# EAGLE design pedometer_blackbox (EAGLE 5.06)
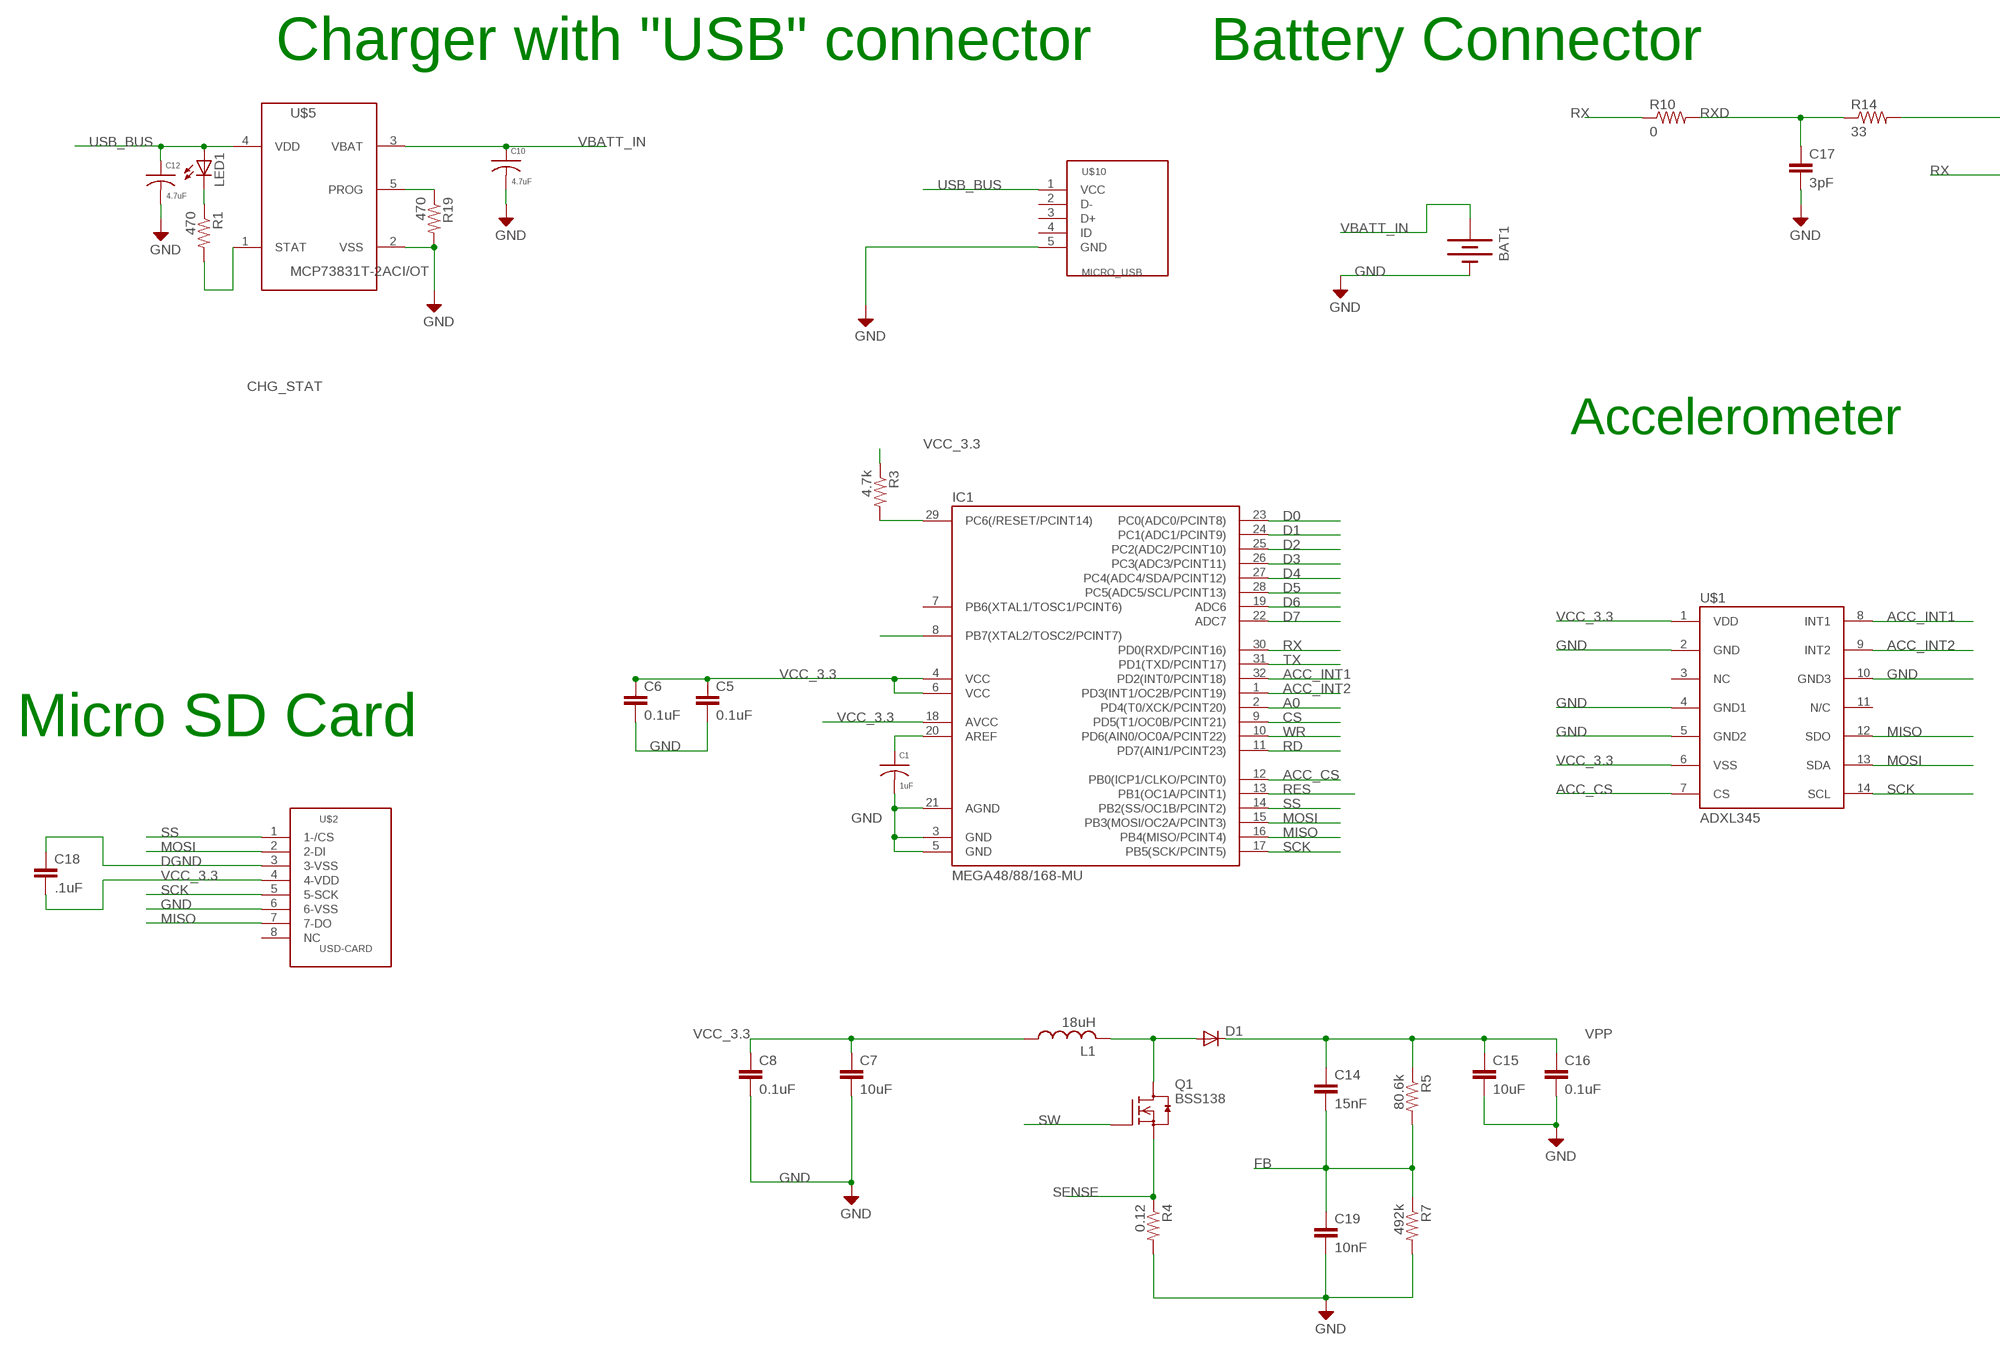
[diagram p0: schematic, sheet 1, part 1 of 2]
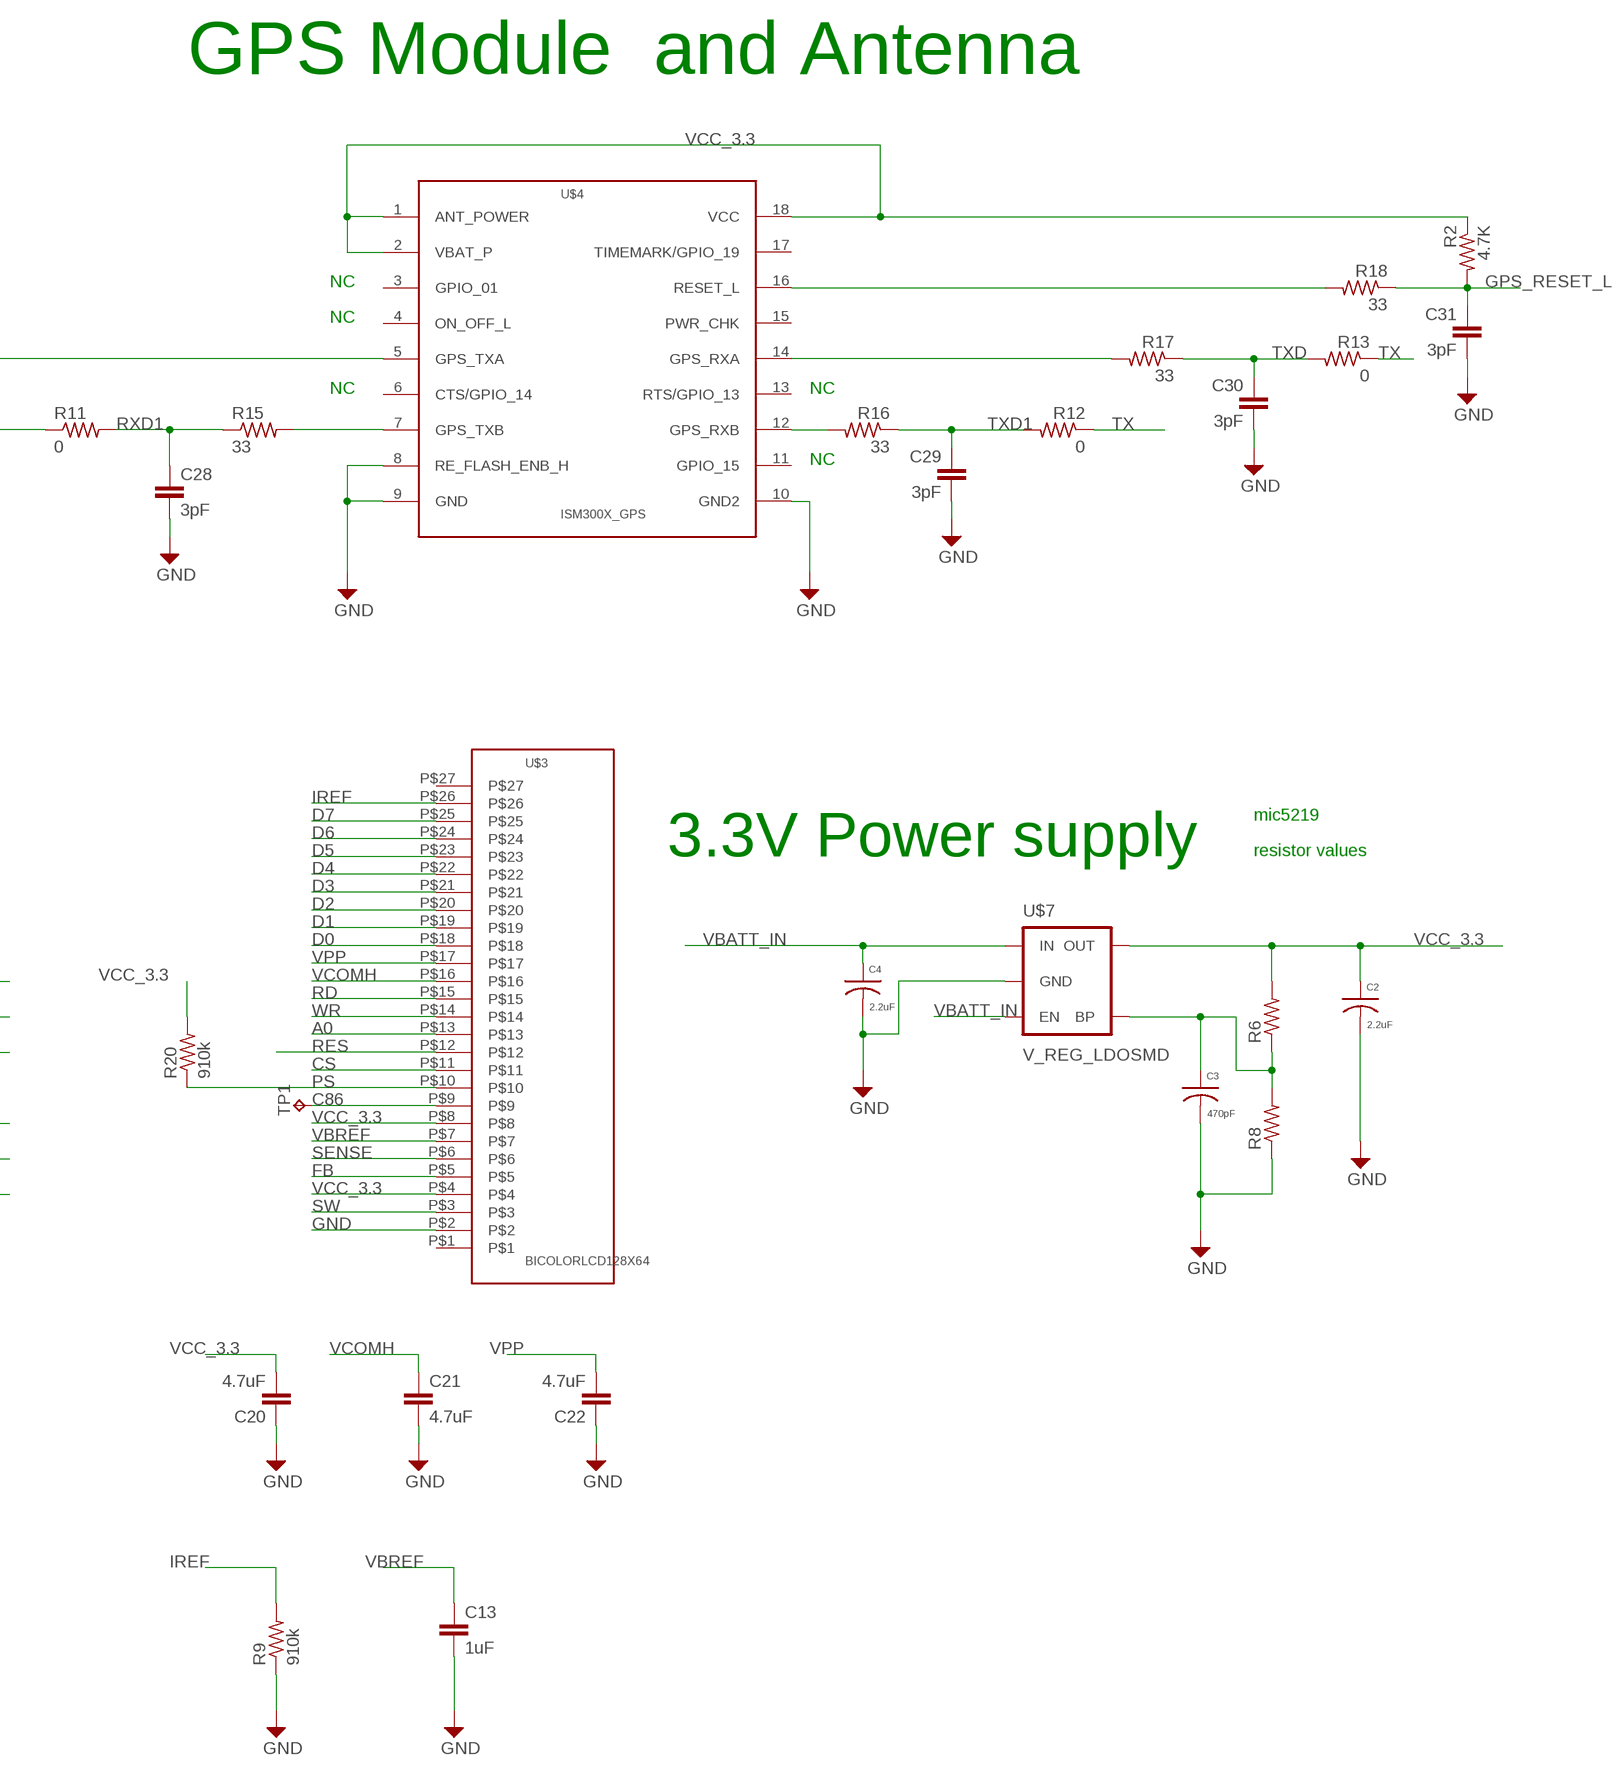
[diagram p1: schematic, sheet 1, part 2 of 2]

## Parts
BAT1  BATTERY20MM_FOB  [FOB_20MM_BAT]
C1  1uF  C0402  [C0402]
C2  2.2uF  C0603  [C0603]
C3  470pF  C0603  [C0603]
C4  2.2uF  C0603  [C0603]
C5  0.1uF  C-EUC0402  [C0402]
C6  0.1uF  C-EUC0402  [C0402]
C7  10uF  C-EUC0603  [C0603]
C8  0.1uF  C-EUC0402  [C0402]
C10  4.7uF  C0603  [C0603]
C12  4.7uF  C0603  [C0603]
C13  1uF  C-EUC0603  [C0603]
C14  15nF  C-EUC0402  [C0402]
C15  10uF  C-EUC0603  [C0603]
C16  0.1uF  C-EUC0402  [C0402]
C17  3pF  C-EUC0402  [C0402]
C18  .1uF  C-EUC0603  [C0603]
C19  10nF  C-EUC0402  [C0402]
C20  4.7uF  C-EUC0603  [C0603]
C21  4.7uF  C-EUC0603  [C0603]
C22  4.7uF  C-EUC0603  [C0603]
C28  3pF  C-EUC0402  [C0402]
C29  3pF  C-EUC0402  [C0402]
C30  3pF  C-EUC0402  [C0402]
C31  3pF  C-EUC0402  [C0402]
D1  DIODE-SOD323-W  [SOD323-W]
IC1  MEGA48/88/168-MU  [MLF32]
L1  18uH  L_US-CDRH5D28  [INDUCTOR_CDRH5]
LED1  LEDCHIP-LED0603  [CHIP-LED0603]
Q1  BSS138  [SOT23]
R1  470  R-US_R0402  [R0402]
R2  4.7K  R-US_R0603  [R0603]
R3  4.7k  R-US_R0402  [R0402]
R4  0.12  R-US_R0402  [R0402]
R5  80.6k  R-US_R0402  [R0402]
R6  R-US_R0402  [R0402]
R7  492k  R-US_R0402  [R0402]
R8  R-US_R0402  [R0402]
R9  910k  R-US_R0402  [R0402]
R10  0  R-US_R0402  [R0402]
R11  0  R-US_R0402  [R0402]
R12  0  R-US_R0603  [R0603]
R13  0  R-US_R0603  [R0603]
R14  33  R-US_R0402  [R0402]
R15  33  R-US_R0402  [R0402]
R16  33  R-US_R0603  [R0603]
R17  33  R-US_R0603  [R0603]
R18  33  R-US_R0603  [R0603]
R19  470  R-US_R0402  [R0402]
R20  910k  R-US_R0402  [R0402]
TP1  TPTP06R  [TP06R]
U$1  ADXL345  [LGA14]
U$2  USD-CARD  [502774-0891]
U$3  BICOLORLCD128X64  [BICOLOR_OLED128X64]
U$4  ISM300X_GPS  [INVENTEKSYS_GPS]
U$5  MCP73831T-2ACI/OT  [SOT23-5L]
U$7  V_REG_LDOSMD  [SOT23-5]
U$10  MICRO_USB  [MICRO_USB]

## Nets
A0: IC1.2(PD4(T0/XCK/PCINT20)) U$3.P$13
ACC_CS: IC1.12(PB0(ICP1/CLKO/PCINT0)) U$1.7(CS)
ACC_INT1: IC1.32(PD2(INT0/PCINT18)) U$1.8(INT1)
ACC_INT2: IC1.1(PD3(INT1/OC2B/PCINT19)) U$1.9(INT2)
C86: TP1.TP U$3.P$9
CHG_STAT: R1.2 U$5.1(STAT)
CS: IC1.9(PD5(T1/OC0B/PCINT21)) U$3.P$11
D0: IC1.23(PC0(ADC0/PCINT8)) U$3.P$18
D1: IC1.24(PC1(ADC1/PCINT9)) U$3.P$19
D2: IC1.25(PC2(ADC2/PCINT10)) U$3.P$20
D3: IC1.26(PC3(ADC3/PCINT11)) U$3.P$21
D4: IC1.27(PC4(ADC4/SDA/PCINT12)) U$3.P$22
D5: IC1.28(PC5(ADC5/SCL/PCINT13)) U$3.P$23
D6: IC1.19(ADC6) U$3.P$24
D7: IC1.22(ADC7) U$3.P$25
DGND: C18.1 U$2.3(3-VSS)
FB: C14.2 C19.1 R5.2 R7.1 U$3.P$5
GND: BAT1.NEG(-) C1.2 C2.2 C3.2 C4.2 C5.2 C6.2 C7.2 C8.2 C10.2 C12.2 C13.2 C15.2 C16.2 C17.2 C19.2 C20.1 C21.2 C22.1 C28.2 C29.2 C30.2 C31.2 IC1.3(GND) IC1.5(GND) IC1.21(AGND) R4.2 R7.2 R8.1 R9.1 R19.2 U$1.2(GND) U$1.4(GND1) U$1.5(GND2) U$1.10(GND3) U$2.6(6-VSS) U$3.P$2 U$4.8(RE_FLASH_ENB_H) U$4.9(GND) U$4.10(GND2) U$5.2(VSS) U$7.2(GND) U$10.5(GND)
GPS_RESET_L: C31.1 R2.2 R18.1
IREF: R9.2 U$3.P$26
MISO: IC1.16(PB4(MISO/PCINT4)) U$1.12(SDO) U$2.7(7-DO)
MOSI: IC1.15(PB3(MOSI/OC2A/PCINT3)) U$1.13(SDA) U$2.2(2-DI)
N$2: IC1.8(PB7(XTAL2/TOSC2/PCINT7))
N$3: D1.A L1.2 Q1.3(D)
N$4: C1.1 IC1.20(AREF)
N$5: R19.1 U$5.5(PROG)
N$15: C3.1 R6.1 R8.2 U$7.4(BP)
N$16: LED1.C R1.1
N$18: R14.2 U$4.5(GPS_TXA)
N$19: R15.2 U$4.7(GPS_TXB)
N$20: R16.2 U$4.12(GPS_RXB)
N$21: R17.2 U$4.14(GPS_RXA)
N$22: R18.2 U$4.16(RESET_L)
N$28: IC1.29(PC6(/RESET/PCINT14)) R3.2
PS: R20.1 U$3.P$10
RD: IC1.11(PD7(AIN1/PCINT23)) U$3.P$15
RES: IC1.13(PB1(OC1A/PCINT1)) U$3.P$12
RX: IC1.30(PD0(RXD/PCINT16)) R10.1 R11.1
RXD: C17.1 R10.2 R14.1
RXD1: C28.1 R11.2 R15.1
SCK: IC1.17(PB5(SCK/PCINT5)) U$1.14(SCL) U$2.5(5-SCK)
SENSE: Q1.2(S) R4.1 U$3.P$6
SS: IC1.14(PB2(SS/OC1B/PCINT2)) U$2.1(1-/CS)
SW: Q1.1(G) U$3.P$3
TX: IC1.31(PD1(TXD/PCINT17)) R12.1 R13.1
TXD: C30.1 R13.2 R17.1
TXD1: C29.1 R12.2 R16.1
USB_BUS: C12.1 LED1.A U$5.4(VDD) U$10.1(VCC)
VBATT_IN: BAT1.POS1(+) C4.1 C10.1 U$5.3(VBAT) U$7.1(IN) U$7.3(EN)
VBREF: C13.1 U$3.P$7
VCC_3.3: C2.1 C5.1 C6.1 C7.1 C8.1 C18.2 C20.2 IC1.4(VCC) IC1.6(VCC) IC1.18(AVCC) L1.1 R2.1 R3.1 R6.2 R20.2 U$1.1(VDD) U$1.6(VSS) U$2.4(4-VDD) U$3.P$4 U$3.P$8 U$4.1(ANT_POWER) U$4.2(VBAT_P) U$4.18(VCC) U$7.5(OUT)
VCOMH: C21.1 U$3.P$16
VPP: C14.1 C15.1 C16.1 C22.2 D1.C R5.1 U$3.P$17
WR: IC1.10(PD6(AIN0/OC0A/PCINT22)) U$3.P$14
Unconnected: IC1.7(PB6(XTAL1/TOSC1/PCINT6)) U$1.3(NC) U$1.11(N/C) U$2.8(NC) U$3.P$1 U$3.P$27 U$4.3(GPIO_01) U$4.4(ON_OFF_L) U$4.6(CTS/GPIO_14) U$4.11(GPIO_15) U$4.13(RTS/GPIO_13) U$4.15(PWR_CHK) U$4.17(TIMEMARK/GPIO_19) U$10.2(D-) U$10.3(D+) U$10.4(ID)

## Notes on the sheet
- GPS Module  and Antenna
- Charger with "USB" connector | Battery Connector | NC
- NC
- NC | NC
- NC
- Accelerometer
- mic5219
- 3.3V Power supply | resistor values
- Micro SD Card

## Library data of the parts
BAT1 = SparkFun:BATTERY: Battery Holders Various common sizes : AA, AAA, 20mm coin cell and 12mm coin cell.
C1-C4 C10 C12 = qualified_1:C
C5-C8 C13-C22 C28-C31 = rcl:C-EU: CAPACITOR, European symbol
D1 = diode:DIODE-: DIODE
IC1 = avr-5:MEGA48/88/168
L1 = m-pad-2.1:L_US: Inductors in various packages from: - Sumida - Panasonic - Coilcraft
LED1 = led:LED: LED OSRAM: - CHIPLED LG R971, LG N971, LY N971, LG Q971, LY Q971, LO R971, LY R971 LH N974, LH R974 LS Q976, LO Q976, LY Q976 LO Q996 - Hyper CHIPLED LW Q18S LB Q993, LB Q99A, LB R99A - SideLED LS A670, LO A670, LY A670, LG A670, LP A670 LB A673, LV A673, LT A673, LW A673 LH A674 LY A675 LS A676, LA A676, LO A676, LY A676, LW A676 LS A679, LY A679, LG A679 - Hyper Micro SIDELED® LS Y876, LA Y876, LO Y876, LY Y876 LT Y87S - SmartLED LW L88C, LW L88S LB L89C, LB L89S, LG L890 LS L89K, LO L89K, LY L89K LS L896, LA L896, LO L896, LY L896 - TOPLED LS T670, LO T670, LY T670, LG T670, LP T670 LSG T670, LSP T670, LSY T670, LOP T670, LYG T670 LG T671, LOG T671, LSG T671 LB T673, LV T673, LT T673, LW T673 LH T674 LS T676, LA T676, LO T676, LY T676, LB T676, LH T676, LSB T676, LW T676 LB T67C, LV T67C, LT T67C, LS T67K, LO T67K, LY T67K, LW E67C LS E67B, LA E67B, LO E67B, LY E67B, LB E67C, LV E67C, LT E67C LW T67C LS T679, LY T679, LG T679 LS T770, LO T770, LY T770, LG T770, LP T770 LB T773, LV T773, LT T773, LW T773 LH T774 LS E675, LA E675, LY E675, LS T675 LS T776, LA T776, LO T776, LY T776, LB T776 LHGB T686 LT T68C, LB T68C - Hyper Mini TOPLED® LB M676 - Mini TOPLED Santana® LG M470 LS M47K, LO M47K, LY M47K Source: http://www.osram.convergy.de LUXEON: - LUMILED® LXK2-PW12-R00, LXK2-PW12-S00, LXK2-PW14-U00, LXK2-PW14-V00 LXK2-PM12-R00, LXK2-PM12-S00, LXK2-PM14-U00 LXK2-PE12-Q00, LXK2-PE12-R00, LXK2-PE12-S00, LXK2-PE14-T00, LXK2-PE14-U00 LXK2-PB12-K00, LXK2-PB12-L00, LXK2-PB12-M00, LXK2-PB14-N00, LXK2-PB14-P00, LXK2-PB14-Q00 LXK2-PR12-L00, LXK2-PR12-M00, LXK2-PR14-Q00, LXK2-PR14-R00 LXK2-PD12-Q00, LXK2-PD12-R00, LXK2-PD12-S00 LXK2-PH12-R00, LXK2-PH12-S00 LXK2-PL12-P00, LXK2-PL12-Q00, LXK2-PL12-R00 Source: www.luxeon.com KINGBRIGHT: KA-3528ASYC Source: www.kingbright.com
Q1 = m-pad-2.1:BSS138: Fairchild Semiconductors BSS138 N-Channel Logic Level Enhancement Mode Field Effect Transistor General Description: These N-Channel enhancement mode field effect transistors are produced using Fairchild's proprietary, high cell density, DMOS technology. These products have been designed to minimize on-state resistance while provide rugged, reliable, and fast switching performance.These products are particularly suited for low voltage, low current applications such as small servo motor control, power MOSFET gate drivers, and other switching applications. Features: 0.22 A, 50 V. RDS(ON) = 3.5Ohm @ VGS = 10 V RDS(ON) = 6.0Ohm @ VGS = 4.5 V High density cell design for extremely low RDS(ON) Rugged and Reliable Compact industry standard SOT-23 surface mount package Please send any comments to: messi@users.sourceforge.net
R1-R20 = rcl:R-US_: RESISTOR, American symbol
TP1 = testpad:TP: Test pad
U$1 = SparkFun:ADXL345
U$2 = m-pad-2.1:USD-CARD
U$3 = m-pad-2.1:BICOLORLCD128X64
U$4 = m-pad-2.0:ISM300X_GPS
U$5 = m-pad-2.1:MCP73831T-2ACI/OT
U$7 = SparkFun-3-2-07:V_REG_LDO: Voltage Regulator LDO Standard 150mA LDO voltage regulator in SOT-23 layout. Micrel part MIC5205. BP (by-pass) pin is used to lower output noise with 470pF cap.
U$10 = camera_project:MICRO_USB

## Board
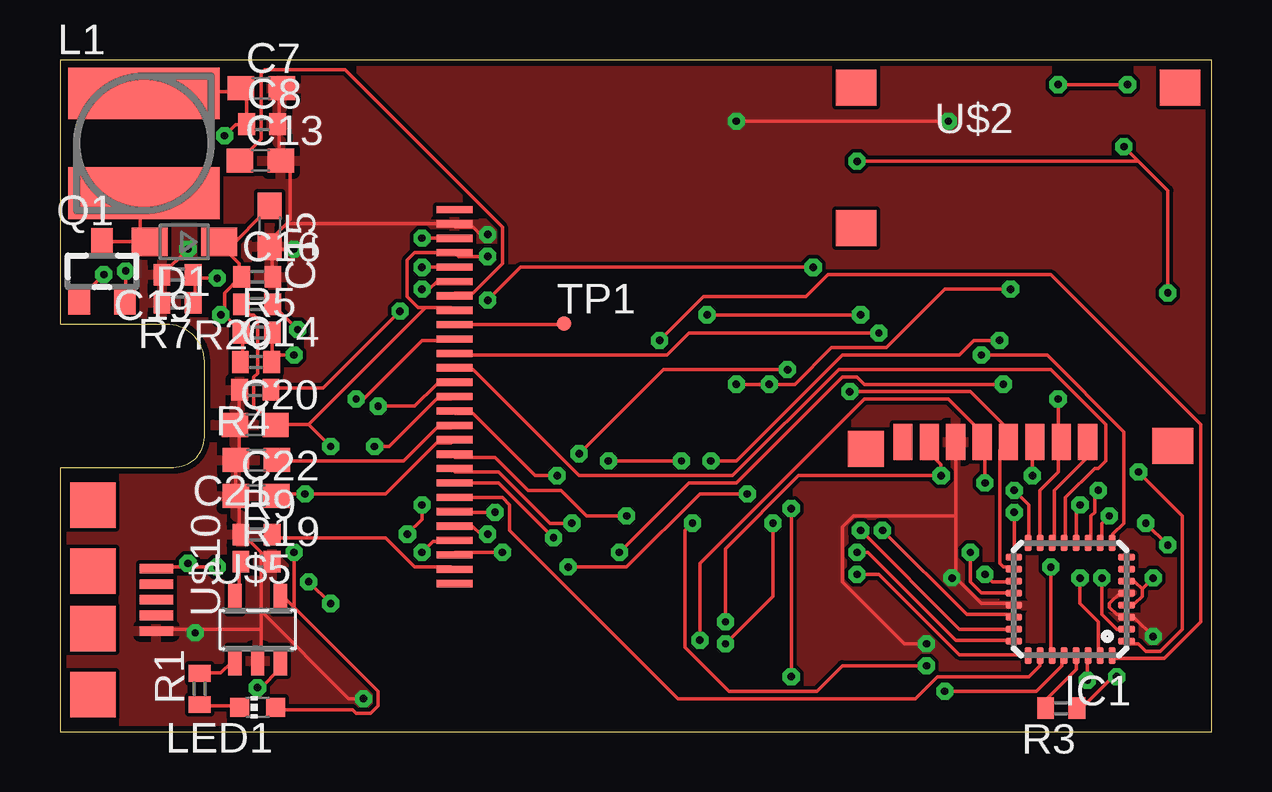
[diagram p2: board, top side]
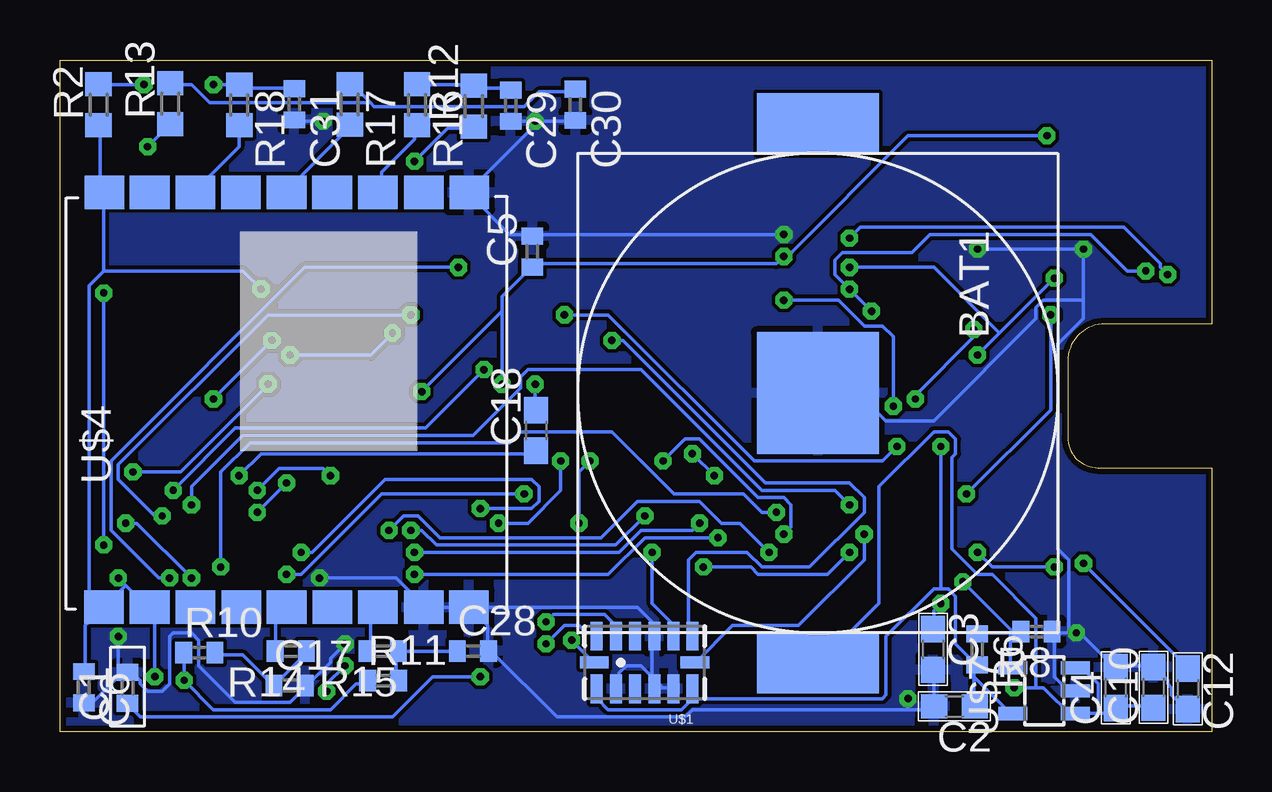
[diagram p3: board, bottom side, seen from below]

Size 48 x 28 mm. Coordinates in mm from the lower left corner, seen from the top.
Outline: 0,0 48,0 48,28 0,28 0,17 4.43,17 arc-90 6,15.43 6,12.27 arc-90 4.73,11 0,11 0,0
Copper layers (1*16): Top 0.035mm / dielectric 1.5mm / Bottom 0.035mm
Design rules "default *": minimum track width 6mil, minimum drill 12mil, track to track 6mil, track to pad 6mil, pad to pad 6mil, via to via 6mil, smd to smd 6mil, copper to edge 10mil, drill to drill 8mil, minimum pad ring 10mil, minimum via ring 8mil, stop-mask expansion 4mil, vias tented up to drill 0mil, thermal gap 10mil

### Footprints (pad centres in the part's own frame; a part is rotated, then mirrored left to right if it is on the bottom)
FOB_20MM_BAT = smd 5.08 x 5.08: NEG 0,0 | smd 2.54 x 5.08: POS1 11.239,0; POS2 -11.239,0
C0402 = smd 0.7 x 0.9: 1 -0.65,0; 2 0.65,0
C0603 = smd 1.1 x 1: 1 -0.85,0; 2 0.85,0
SOD323-W = smd 1.5 x 1.2: A 1.45,0; C -1.45,0
MLF32 = smd 0.7 x 0.3: 1 -2.35,1.75; 2 -2.35,1.25; 3 -2.35,0.75; 4 -2.35,0.25; 5 -2.35,-0.25; 6 -2.35,-0.75; 7 -2.35,-1.25; 8 -2.35,-1.75; 17 2.35,-1.75; 18 2.35,-1.25; 19 2.35,-0.75; 20 2.35,-0.25; 21 2.35,0.25; 22 2.35,0.75; 23 2.35,1.25; 24 2.35,1.75 | smd 0.3 x 0.7: 9 -1.75,-2.35; 10 -1.25,-2.35; 11 -0.75,-2.35; 12 -0.25,-2.35; 13 0.25,-2.35; 14 0.75,-2.35; 15 1.25,-2.35; 16 1.75,-2.35; 25 1.75,2.35; 26 1.25,2.35; 27 0.75,2.35; 28 0.25,2.35; 29 -0.25,2.35; 30 -0.75,2.35; 31 -1.25,2.35; 32 -1.75,2.35
INDUCTOR_CDRH5 = smd 6.3 x 2.15: 1 0,2.075; 2 0,-2.075
CHIP-LED0603 = smd 0.8 x 0.8: A 0,-0.75; C 0,0.75
SOT23 = smd 0.9 x 1.2: 1 -0.95,-1.2; 2 0.95,-1.2; 3 0,1.2
R0402 = smd 0.7 x 0.9: 1 -0.65,0; 2 0.65,0
R0603 = smd 1 x 1.1: 1 -0.85,0; 2 0.85,0
TP06R = smd 0.6 x 0.6: TP 0,0
LGA14 = smd 0.5 x 1.2: 1 2,1.1; 2 1.2,1.1; 3 0.4,1.1; 4 -0.4,1.1; 5 -1.2,1.1; 6 -2,1.1; 8 -2,-1.1; 9 -1.2,-1.1; 10 -0.4,-1.1; 11 0.4,-1.1; 12 1.2,-1.1; 13 2,-1.1 | smd 1.2 x 0.5: 7 -2.1,0; 14 2.1,0
502774-0891 = smd 0.8 x 1.5: 1 2.9,-15.61; 2 1.8,-15.61; 3 0.7,-15.61; 4 -0.4,-15.61; 5 -1.5,-15.61; 6 -2.6,-15.61; 7 -3.7,-15.61; 8 -4.8,-15.61 | smd 1.7 x 1.5: P$1 -6.75,-0.85; P$2 6.75,-0.85; P$3 -6.75,-6.7; P$12 6.45,-15.79 | smd 1.5 x 1.5: P$13 -6.346,-15.898
BICOLOR_OLED128X64 = smd 0.3 x 1.5: P$1 0,0; P$2 0.6,0; P$3 1.2,0; P$4 1.8,0; P$5 2.4,0; P$6 3,0; P$7 3.6,0; P$8 4.2,0; P$9 4.8,0; P$10 5.4,0; P$11 6,0; P$12 6.6,0; P$13 7.2,0; P$14 7.8,0; P$15 8.4,0; P$16 9,0; P$17 9.6,0; P$18 10.2,0; P$19 10.8,0; P$20 11.4,0; P$21 12,0; P$22 12.6,0; P$23 13.2,0; P$24 13.8,0; P$25 14.4,0; P$26 15,0; P$27 15.6,0
INVENTEKSYS_GPS = smd 1.4 x 1.65: 1 -8.644,7.612; 2 -8.644,5.709; 3 -8.645,3.807; 4 -8.645,1.894; 5 -8.643,0; 6 -8.647,-1.907; 7 -8.645,-3.807; 8 -8.645,-5.709; 9 -8.646,-7.599; 10 8.644,-7.612; 11 8.644,-5.709; 12 8.645,-3.807; 13 8.645,-1.894; 14 8.643,0; 15 8.647,1.907; 16 8.645,3.807; 17 8.645,5.709; 18 8.646,7.599
SOT23-5L = smd 0.55 x 1.2: 1 -0.95,-1.3; 2 0,-1.3; 3 0.95,-1.3; 4 0.95,1.3; 5 -0.95,1.3
SOT23-5 = smd 0.55 x 1.2: 1 -0.95,-1.3; 2 0,-1.3; 3 0.95,-1.3; 4 0.95,1.3; 5 -0.95,1.3
MICRO_USB = smd 0.4 x 1.4: 1 -1.3,0; 2 -0.65,0; 3 0,0; 4 0.65,0; 5 1.3,0 | smd 1.9 x 1.9: P$6 3.95,-2.65; P$7 -3.95,-2.65; P$8 -1.2,-2.65; P$9 1.2,-2.65

### Placement (x,y rotation side)
BAT1  16.41,14.11 270 bottom
C1  45.18,1.82 90 bottom
C2  10.72,1.05 180 bottom
C3  11.61,3.42 270 bottom
C4  3.99,1.83 90 bottom
C5  28.31,20.01 90 bottom
C6  47.01,1.85 270 bottom
C7  8.39,26.81 0 top
C8  8.43,25.32 0 top
C10  2.42,1.84 90 bottom
C12  0.99,1.78 270 bottom
C13  8.36,23.8 0 top
C14  8.17,15.41 0 top
C15  8.75,21.06 270 top
C16  8.23,18.96 0 top
C17  38.44,1.92 0 bottom
C18  28.15,12.55 90 bottom
C19  4.9,19.05 180 top
C20  8.14,12.78 0 top
C21  8.19,11.31 180 top
C22  8.18,9.82 0 top
C28  30.79,3.36 0 bottom
C29  29.21,26.09 270 bottom
C30  26.52,26.13 270 bottom
C31  38.23,26.15 270 bottom
D1  5.18,20.41 180 top
IC1  42.11,5.52 180 top
L1  3.5,24.52 0 top
LED1  8.24,1.01 90 top
Q1  1.75,19.19 0 top
R1  5.82,1.78 90 top
R2  46.39,26.14 90 bottom
R3  41.73,0.97 180 top
R4  8.14,14.24 180 top
R5  8.2,16.63 0 top
R6  9.77,3.43 270 bottom
R7  4.9,17.88 180 top
R8  7.29,4.17 180 bottom
R9  8.19,8.22 0 top
R10  42.19,3.29 0 bottom
R11  34.53,2.13 0 bottom
R12  30.75,26.07 90 bottom
R13  43.41,26.18 90 bottom
R14  38.38,3.35 180 bottom
R15  34.55,3.36 180 bottom
R16  33.12,26.13 270 bottom
R17  35.92,26.15 270 bottom
R18  40.53,26.13 270 bottom
R19  8.19,7.08 0 top
R20  8.22,17.82 180 top
TP1  21.01,17.02 0 top
U$1  23.63,2.88 180 bottom
U$2  39.93,27.69 0 top
U$3  16.45,21.76 270 top
U$4  38.55,13.83 90 bottom
U$5  8.24,4.25 0 top
U$7  6.98,1.7 90 bottom
U$10  4.02,5.5 270 top

### Tracks (layer width: path | path; a pad name or v marks a point on that pad's centre or on a via)
A0  (via drill 0.3)
  Top 0.152: v43.43,6.4 43.43,4.88 44.04,4.27 44.35,4.27 IC1.2 | v31.39,19.36 19.2,19.36 v17.83,17.98 | v13.26,13.56 14.78,13.56 15.7,14.48 16.31,14.48 U$3.P$13
  Bottom 0.152: v43.43,6.4 43.89,6.4 45.87,8.38 45.87,11.28 37.8,19.36 v31.39,19.36 | v17.83,17.98 15.54,17.98 14.48,16.92 13.72,16.92 13.26,16.46 v13.26,13.56
ACC_CS  (via drill 0.3)
  Top 0.152: v42.52,9.45 42.37,9.3 42.37,7.92 IC1.12 | v15.09,9.45 15.09,8.84 v14.48,8.23
  Bottom 0.152: v42.52,9.45 42.52,10.21 40.39,12.34 30.79,12.34 28.8,14.33 28.8,14.78 28.5,15.09 23.77,15.09 18.75,10.06 15.7,10.06 v15.09,9.45 | v14.48,8.23 14.48,7.16 17.22,4.42 19.96,4.42 21.49,2.9 U$1.7
ACC_INT1  (via drill 0.3)
  Top 0.152: v24.99,16.31 26.82,18.14 31.09,18.14 32,19.05 41.3,19.05 47.55,12.8 47.55,4.57 46.02,3.05 43.89,3.05 IC1.32
  Bottom 0.152: v24.99,16.31 24.54,16.31 18.59,10.36 15.09,10.36 14.48,9.75 14.48,9.14 16.76,6.86 18.75,6.86 19.36,7.47 21.49,7.47 21.79,7.16 21.79,4.27 21.64,4.12 U$1.8
ACC_INT2  (via drill 0.3)
  Top 0.152: v44.96,10.82 46.79,8.99 46.79,4.27 45.87,3.35 45.26,3.35 44.96,3.66 44.5,3.66 IC1.1 | v39.32,14.48 33.53,14.48 33.22,14.78 32.61,14.78 28.19,10.36 26.21,10.36 v23.32,7.47
  Bottom 0.152: v44.96,10.82 42.98,10.82 v39.32,14.48 | v23.32,7.47 23.32,5.33 22.55,4.57 22.55,4.12 U$1.9
C86
  Top 0.152: U$3.P$9 21.01,16.96 TP1.TP
CHG_STAT
  Top 0.152: R1.2 5.94,2.44 6.71,2.44 7.16,2.9 U$5.1
CS  (via drill 0.3)
  Top 0.152: v38.41,15.7 41.15,15.7 44.35,12.5 44.35,8.69 43.89,8.23 43.89,7.92 IC1.9 | v34.14,16.61 26.21,16.61 25.3,15.7 16.46,15.7 U$3.P$11
  Bottom 0.152: v38.41,15.7 35.05,15.7 v34.14,16.61
D0  (via drill 0.3)
  Top 0.152: v33.38,8.38 37.49,4.27 39.62,4.27 IC1.23 | v23.62,8.99 21.95,8.99 20.88,10.06 19.51,10.06 18.14,11.43 16.46,11.43 U$3.P$18
  Bottom 0.152: v33.38,8.38 32.92,8.38 32.31,7.77 24.84,7.77 v23.62,8.99
D1  (via drill 0.3)
  Top 0.152: v33.22,7.47 33.68,7.47 37.34,3.81 39.62,3.81 IC1.24 | v21.34,8.69 20.42,8.69 18.29,10.82 16.46,10.82 U$3.P$19
  Bottom 0.152: v33.22,7.47 24.69,7.47 23.77,8.38 21.64,8.38 v21.34,8.69
D2  (via drill 0.3)
  Top 0.152: v33.22,6.55 34.14,6.55 37.49,3.2 40.23,3.2 IC1.25 | v20.57,8.08 18.29,10.36 U$3.P$20
  Bottom 0.152: v33.22,6.55 25.15,6.55 23.62,8.08 v20.57,8.08
D3
  Top 0.152: IC1.26 40.84,3.05 40.84,2.74 40.39,2.29 36.58,2.29 35.66,1.37 25.76,1.37 18.75,8.38 18.75,9.45 18.44,9.75 U$3.P$21
D4  (via drill 0.3)
  Top 0.152: v41.3,6.86 41.3,3.2 IC1.27 | v18.14,9.14 16.46,9.14 U$3.P$22
  Bottom 0.152: v41.3,6.86 41.3,10.82 40.08,12.04 29.26,12.04 28.8,12.5 24.99,12.5 22.4,9.91 19.51,9.91 18.75,9.14 v18.14,9.14
D5  (via drill 0.3)
  Top 0.152: v36.88,1.68 40.69,1.68 41.76,2.74 41.76,3.05 IC1.28 | v36.12,2.74 32.61,2.74 31.55,1.68 27.89,1.68 26.06,3.5 26.06,8.38 v26.36,8.69 | v22.86,11.28 v25.91,11.28 | v17.83,8.23 17.53,8.23 17.22,8.53 16.46,8.53 U$3.P$23
  Bottom 0.152: v36.88,1.68 36.88,1.98 v36.12,2.74 | v26.36,8.69 26.36,10.82 v25.91,11.28 | v22.86,11.28 21.95,12.19 21.34,12.19 18.9,9.75 17.83,9.75 17.53,9.45 17.53,8.53 v17.83,8.23
D6  (via drill 0.3)
  Top 0.152: v38.56,6.55 38.86,6.25 39.62,6.25 IC1.19 | v28.65,9.91 26.67,9.91 23.62,6.86 v21.18,6.86 | v15.09,7.47 15.54,7.92 16.31,7.92 U$3.P$24
  Bottom 0.152: v38.56,6.55 37.95,6.55 34.59,9.91 v28.65,9.91 | v21.18,6.86 19.2,6.86 18.9,6.55 16,6.55 v15.09,7.47
D7  (via drill 0.3)
  Top 0.152: v34.29,8.38 37.8,4.88 39.62,4.88 IC1.22 | v18.44,7.47 16.46,7.47 U$3.P$25
  Bottom 0.152: v34.29,8.38 33.68,8.99 33.07,8.99 32.16,8.08 25.45,8.08 23.93,9.6 21.34,9.6 20.42,8.69 19.66,8.69 v18.44,7.47
DGND  (via drill 0.3)
  Top 0.152: v40.54,10.67 40.54,12.04 U$2.3
  Bottom 0.152: v40.54,10.67 39.62,11.58 28.19,11.58 C18.1
FB  (via drill 0.3)
  Top 0.152: 5.64,18.9 5.64,19.05 C19.1 5.64,18.9 | 5.64,18.9 5.64,17.98 R7.1 | 8.84,15.7 8.84,16.61 R5.2 | 8.84,15.7 8.84,15.54 C14.2 8.84,15.7 | 5.64,18.9 v6.55,18.9 | v9.75,15.7 8.84,15.7 | v15.09,19.36 16.31,19.36 U$3.P$5
  Bottom 0.152: 8.84,16.61 v9.75,15.7 | v6.55,18.9 8.84,16.61 | v15.09,19.36 11.58,19.36 8.84,16.61
GND  (via drill 0.3)
  Top 0.152: IC1.5 44.35,5.79 44.2,5.79 43.74,5.33 43.74,5.18 44.04,4.88 44.35,4.88 IC1.3 44.5,4.72 44.81,4.72 v45.57,3.96 | 37.34,6.4 38.41,5.33 39.62,5.33 IC1.21 | 37.34,8.99 37.34,12.04 U$2.6 | 37.34,6.4 37.34,8.99 | v37.19,6.4 37.34,6.4 | v36.12,3.66 35.2,3.66 32.61,6.25 32.61,8.53 33.07,8.99 37.34,8.99 | 7.47,12.8 7.47,11.43 C21.2 7.32,11.28 7.32,9.91 C22.1 7.47,9.75 7.47,8.23 R9.1 7.62,8.23 8.38,7.47 | 7.47,12.8 7.47,14.17 R4.2 | 7.47,12.8 7.32,12.8 C20.1 | 8.38,7.47 8.69,7.16 R19.2 | 8.38,5.03 8.38,7.47 | 8.38,4.27 8.38,5.03 | 8.38,4.27 8.38,3.05 U$5.2 | 5.64,4.27 8.38,4.27 | 5.64,4.27 4.12,4.27 U$10.5 | v28.19,25.45 v37.03,25.45 | 8.84,20.12 8.84,19.05 C16.2 | C7.2 9.14,26.67 9.14,25.45 C8.2 9.14,25.3 9.14,23.93 C13.2 9.3,23.77 9.6,23.47 9.6,21.34 9.45,21.18 | 9.45,21.18 8.84,20.57 8.84,20.27 C15.2 8.84,20.12 | 9.45,21.18 16.31,21.18 U$3.P$2 16.46,21.03 17.22,21.03 17.53,20.73 v17.83,20.73 | 4.27,19.05 4.27,17.98 R7.2 | v5.33,20.12 4.27,19.05 | 4.27,19.05 C19.2 | v9.75,20.12 8.84,20.12 | v5.64,4.12 5.64,4.27 | v12.65,1.37 12.04,1.37 8.38,5.03
  Bottom 0.152: C1.2 45.11,2.59 44.65,2.13 44.65,1.98 44.35,1.68 43.74,1.68 43.43,1.98 43.43,3.96 43.28,4.12 42.52,4.12 42.22,3.81 42.22,2.74 40.69,1.22 38.41,1.22 37.8,1.83 C17.2 37.64,1.98 36.73,2.9 36.73,3.05 v36.12,3.66 | 45.57,2.29 45.26,2.59 C1.2 | 45.57,2.29 46.63,1.22 46.94,1.22 C6.2 | 45.57,2.29 v45.57,3.96 | C1.2 45.57,2.29 | 22.86,1.83 23.16,1.83 U$1.4 23.32,2.29 | 22.86,1.83 22.55,1.83 U$1.5 | 23.32,2.29 22.86,1.83 | 23.32,2.29 23.77,2.74 24.38,2.74 24.69,2.44 24.69,1.83 U$1.2 | 23.32,2.29 23.32,3.96 U$1.10 23.32,4.12 23.32,4.57 23.93,5.18 30.94,5.18 | C3.2 11.58,2.44 11.58,1.07 C2.2 11.58,0.91 12.65,0.91 | 30.94,5.18 30.18,4.42 30.18,3.5 C28.2 30.02,3.35 27.28,0.61 21.95,0.61 21.64,0.91 12.65,0.91 | 30.94,5.18 U$4.9 31.09,5.18 32.77,5.18 U$4.8 32.92,5.33 33.98,6.4 v37.19,6.4 | 28.04,25.45 26.67,25.45 C30.2 | C29.2 29.11,25.45 v28.19,25.45 28.04,25.45 | v37.03,25.45 38.1,25.45 C31.2 | 28.04,25.45 30.94,22.55 U$4.10 30.94,22.4 29.26,20.73 28.35,20.73 C5.2 28.19,20.73 v17.83,20.73 | 5.94,4.12 v5.64,4.12 5.49,4.12 4.12,2.74 C4.2 3.96,2.74 2.44,2.74 C10.2 2.29,2.59 1.83,2.13 1.83,1.98 1.68,1.83 1.68,1.52 1.52,1.37 1.37,1.37 1.07,1.07 C12.2 | 5.94,4.12 6.55,4.12 | 6.55,4.12 6.55,2.29 6.1,1.83 5.79,1.83 U$7.2 | 6.55,4.12 R8.1 | 5.33,17.98 5.33,17.22 6.4,16.15 6.4,7.62 5.94,7.16 5.94,4.12 | 5.33,17.98 v5.33,20.12 v9.75,20.12 | 5.33,17.98 7.01,17.98 7.32,17.68 7.32,17.22 11.58,12.95 13.56,12.95 14.63,14.02 16.31,14.02 BAT1.NEG | v12.65,1.37 12.65,0.91
  pour Bottom: -0.63,28.63 49.14,28.63 49.14,-2.33 -0.68,-2.33 -0.68,28.05
  pour Top: -0.83,28.83 49.53,28.83 49.53,-3.35 -0.83,-3.35 -0.83,28.29
GPS_RESET_L  (via drill 0.3)
  Top 0.152: v41.6,26.98 v44.5,26.98
  Bottom 0.152: C31.1 38.25,26.82 40.23,26.82 40.39,26.98 R18.1 v41.6,26.98 | v44.5,26.98 46.33,26.98 R2.2
IREF
  Top 0.152: R9.2 8.99,8.08 13.56,8.08 14.78,6.86 16.31,6.86 U$3.P$26
MISO  (via drill 0.3)
  Top 0.152: v39.78,10.06 40.39,9.45 40.39,7.92 IC1.16 | U$2.7 36.27,12.04 36.27,11.58 36.73,11.12 v36.73,10.67 30.79,10.67 27.74,7.62 v27.74,4.57
  Bottom 0.152: v39.78,10.06 38.86,10.97 37.03,10.97 v36.73,10.67 | v27.74,4.57 27.43,4.88 25.3,4.88 24.84,4.42 24.84,4.12 U$1.12
MOSI  (via drill 0.3)
  Top 0.152: IC1.15 40.84,7.92 40.84,10.06 41.6,10.82 41.6,12.04 U$2.2 41.6,12.19 v41.6,13.87 | v27.74,3.66 29.72,5.64 v29.72,8.69 | v27.13,11.28 28.19,11.28 32.61,15.7 37.49,15.7 38.1,16.31 v39.17,16.31
  Bottom 0.152: v27.74,3.66 26.98,4.42 26.36,4.42 26.06,4.12 25.76,4.12 U$1.13 | v29.72,8.69 28.5,8.69 27.13,10.06 v27.13,11.28 | v39.17,16.31 v41.6,13.87
N$3
  Top 0.152: 3.35,20.42 3.66,20.42 D1.A 3.35,20.42 | 3.35,20.42 1.83,20.42 Q1.3 | 3.35,20.42 3.35,22.4 L1.2
N$4  (via drill 0.3)
  Top 0.152: v37.95,7.47 37.95,6.25 38.41,5.79 39.62,5.79 IC1.20 | v30.48,2.29 v30.48,9.3
  Bottom 0.152: v37.95,7.47 37.49,7.47 34.44,10.52 28.35,10.52 28.04,10.21 28.04,9.6 28.35,9.3 v30.48,9.3 | v30.48,2.29 32.46,2.29 34.14,0.61 44.65,0.61 45.11,1.07 C1.1
N$5
  Top 0.152: R19.1 7.47,7.01 7.47,5.79 7.32,5.64 U$5.5
N$15  (via drill 0.3)
  Top 0.152: v10.36,6.25 v11.28,5.33
  Bottom 0.152: 8.38,4.12 9.75,4.12 R6.1 | 8.23,4.12 8.38,4.12 | 8.23,4.12 8.08,4.12 R8.2 8.23,4.12 | v11.28,5.33 11.58,5.03 11.58,4.42 C3.1 | 8.23,4.12 v10.36,6.25 | 8.38,4.12 8.38,2.74 U$7.4
N$16
  Top 0.152: LED1.C 7.47,1.07 5.94,1.07 R1.1
N$18
  Bottom 0.152: R14.2 39.01,3.35 39.01,4.72 U$4.5
N$19
  Bottom 0.152: R15.2 35.05,3.5 35.05,4.88 U$4.7
N$20
  Bottom 0.152: R16.2 33.22,25.15 33.22,24.69 34.59,23.32 34.59,22.55 U$4.12
N$21
  Bottom 0.152: R17.2 35.97,25.15 38.56,22.55 U$4.14
N$22
  Bottom 0.152: R18.2 40.54,25.15 40.54,24.38 42.37,22.55 U$4.16
N$28
  Top 0.152: IC1.29 42.37,3.05 42.37,2.59 41,1.22 41,0.76 R3.2
PS  (via drill 0.3)
  Top 0.152: v9.91,16.76 8.99,17.68 R20.1 | v12.34,13.87 12.65,13.87 15.09,16.31 16.31,16.31 U$3.P$10
  Bottom 0.152: v9.91,16.76 9.91,16.46 12.34,14.02 v12.34,13.87
RD  (via drill 0.3)
  Top 0.152: v43.28,10.06 43.13,9.91 43.13,9.14 42.98,8.99 42.98,7.92 IC1.11 | v30.33,15.09 25.15,15.09 v21.64,11.58 | v20.73,10.67 19.81,10.67 17.22,13.26 16.46,13.26 U$3.P$15
  Bottom 0.152: v43.28,10.06 40.69,12.65 32.77,12.65 v30.33,15.09 | v20.73,10.67 v21.64,11.58
RES
  Top 0.152: IC1.13 41.91,7.92 41.91,9.75 43.13,10.97 43.28,10.97 43.59,11.28 43.59,12.8 41.3,15.09 32.46,15.09 28.04,10.67 21.64,10.67 17.22,15.09 16.46,15.09 U$3.P$12
RX  (via drill 0.3)
  Top 0.152: v42.82,2.13 42.82,3.05 IC1.30
  Bottom 0.152: R10.1 42.82,3.2 v42.82,2.13 41.6,0.91 36.73,0.91 35.66,1.98 35.2,1.98 R11.1
RXD
  Bottom 0.152: R14.1 37.8,3.2 39.01,1.98 C17.1 39.17,1.98 40.39,3.2 41.45,3.2 R10.2
RXD1
  Bottom 0.152: R11.2 33.98,2.13 33.98,3.35 R15.1 33.83,3.35 31.55,3.35 C28.1
SCK  (via drill 0.3)
  Top 0.152: v39.78,9.14 39.78,7.32 IC1.17 | v38.56,10.36 38.56,12.04 U$2.5 38.41,12.19 38.41,12.5 37.03,13.87 33.53,13.87 26.67,7.01 v26.67,3.81
  Bottom 0.152: v38.56,10.36 v39.78,9.14 | v26.67,3.81 25.76,2.9 U$1.14
SENSE  (via drill 0.3)
  Top 0.152: v14.17,17.53 10.97,14.33 8.84,14.33 R4.1 | v15.09,18.44 15.39,18.44 15.7,18.75 16.31,18.75 U$3.P$6 | v2.74,19.2 2.74,18.14 Q1.2
  Bottom 0.152: v14.17,17.53 v15.09,18.44 15.7,19.05 15.7,19.66 15.39,19.96 12.5,19.96 11.73,20.73 5.03,20.73 3.5,19.2 v2.74,19.2
SS
  Top 0.152: IC1.14 41.45,7.92 41.45,10.06 42.82,11.43 42.82,12.04 U$2.1
SW  (via drill 0.3)
  Top 0.152: v1.83,19.05 0.91,18.14 Q1.1 | v15.09,20.57 16.31,20.57 U$3.P$3
  Bottom 0.152: v1.83,19.05 2.13,19.36 2.13,19.51 3.66,21.03 14.63,21.03 v15.09,20.57
TX  (via drill 0.3)
  Top 0.152: v42.52,6.4 42.52,5.33 43.28,4.57 43.28,3.2 IC1.31 | v45.26,8.69 v46.18,7.77 | v46.18,18.29 46.18,22.55 44.96,23.77 | 44.96,23.77 v44.35,24.38 | 44.96,23.77 v33.22,23.77
  Bottom 0.152: v42.52,6.4 44.81,8.69 v45.26,8.69 | v46.18,7.77 v46.18,18.29 | v44.35,24.38 43.43,25.3 R13.1 | v33.22,23.77 31.85,25.15 30.79,25.15 R12.1
TXD
  Bottom 0.152: 35.05,26.21 35.81,26.98 R17.1 | 35.05,26.21 34.9,26.06 28.65,26.06 28.04,26.67 26.67,26.67 C30.1 | 35.05,26.21 41.76,26.21 42.52,26.98 43.28,26.98 R13.2
TXD1
  Bottom 0.152: C29.1 29.26,26.82 30.63,26.82 R12.2 30.79,26.98 33.07,26.98 R16.1
USB_BUS  (via drill 0.3)
  Top 0.152: 9.75,5.18 9.3,5.64 U$5.4 | 9.75,5.18 13.26,1.68 13.26,1.07 12.95,0.76 12.34,0.76 12.19,0.91 8.99,0.91 LED1.A | 5.33,6.86 v6.55,6.86 | 5.33,6.86 4.12,6.86 U$10.1 | v9.75,7.47 9.75,5.18 | v5.33,7.01 5.33,6.86
  Bottom 0.152: v6.55,6.86 9.14,6.86 v9.75,7.47 | v5.33,7.01 1.07,2.74 C12.1
VBATT_IN  (via drill 0.3)
  Top 0.152: v8.23,1.83 8.38,1.83 9.14,2.59 9.14,2.9 U$5.3
  Bottom 0.152: C10.1 2.44,1.07 3.96,1.07 C4.1 4.12,0.91 4.27,0.76 4.72,0.76 | 4.72,0.76 5.64,0.76 U$7.1 5.79,0.61 7.01,1.83 7.32,1.83 | 4.72,0.76 4.72,1.98 5.33,2.59 5.64,2.59 U$7.3 | 7.32,1.83 v8.23,1.83 | 7.32,1.83 7.32,4.72 9.14,6.55 9.75,6.55 10.82,7.62 10.82,11.43 10.67,11.58 10.67,12.19 10.97,12.5 11.58,12.5 13.87,10.21 13.87,5.33 16.31,2.9 BAT1.POS1
VBREF
  Top 0.152: C13.1 7.62,23.93 8.38,24.69 8.38,27.43 8.53,27.58 11.89,27.58 18.44,21.03 18.44,19.51 17.22,18.29 16.46,18.29 U$3.P$7
VCC_3.3  (via drill 0.3)
  Top 0.152: 45.11,5.94 45.11,5.64 44.81,5.33 44.5,5.33 IC1.4 | 45.11,5.94 44.81,6.25 44.5,6.25 IC1.6 | v44.04,2.29 43.89,2.29 42.37,0.76 R3.1 | v45.57,6.4 45.11,5.94 | L1.1 3.5,26.67 7.47,26.67 C7.1 7.62,26.67 7.77,26.52 7.77,25.45 C8.1 7.77,25.3 7.32,25.3 v6.86,24.84 | R20.2 7.62,17.68 7.92,17.37 8.08,17.37 8.23,17.22 8.23,14.94 8.08,14.78 8.08,13.56 8.84,12.8 C20.2 8.99,12.8 10.36,12.8 | IC1.18 39.62,6.86 39.32,6.86 39.17,7.01 39.17,11.73 39.47,12.04 U$2.4 39.47,12.19 39.47,12.65 37.95,14.17 v32.92,14.17 | v17.83,19.81 16.61,19.81 U$3.P$4 16.31,19.96 14.78,19.96 14.48,19.66 14.48,18.14 14.94,17.68 15.24,17.68 | v28.19,14.48 v29.57,14.48 30.63,14.48 32.16,16 34.44,16 36.88,18.44 v39.62,18.44 | 15.24,17.68 16.31,17.68 U$3.P$8 | 10.36,12.8 15.24,17.68 | v11.28,11.89 10.36,12.8
  Bottom 0.152: v44.04,2.29 44.04,5.03 44.2,5.18 U$4.2 44.35,5.18 45.26,6.1 | 45.26,6.1 v45.57,6.4 | R2.1 46.33,25.15 46.33,22.71 46.18,22.55 U$4.18 46.18,22.4 46.18,19.2 | 46.79,4.57 46.18,5.18 U$4.1 | 46.79,4.57 46.94,4.42 46.94,2.59 C6.1 | 46.18,19.2 46.79,18.59 46.79,4.57 | 46.79,4.57 U$4.1 | 45.26,6.1 46.02,5.33 U$4.1 | 9.91,2.29 9.91,1.07 C2.1 | 9.91,2.29 9.91,2.74 R6.2 9.91,2.9 10.67,3.66 10.67,5.64 10.97,5.94 11.28,5.94 | 9.91,2.29 8.38,0.76 U$7.5 | 21.64,1.37 21.64,1.68 U$1.6 21.64,1.37 | 21.64,1.37 22.1,0.91 25.15,0.91 25.6,1.37 25.6,1.68 U$1.1 | 11.28,5.94 11.58,5.94 13.56,3.96 13.56,1.52 13.72,1.37 21.64,1.37 | v28.19,14.48 28.19,13.41 C18.2 | 29.57,17.53 29.57,18.14 28.35,19.36 C5.1 28.19,19.51 18.14,19.51 v17.83,19.81 17.68,19.81 12.65,24.84 v6.86,24.84 | 29.57,17.53 v29.57,14.48 | 29.57,17.53 v32.92,14.17 | 11.28,5.94 v11.28,11.89 | 46.18,19.2 40.39,19.2 v39.62,18.44
VCOMH
  Top 0.152: C21.1 9.14,11.28 14.33,11.28 15.7,12.65 16.31,12.65 U$3.P$16
VPP  (via drill 0.3)
  Top 0.152: C14.1 7.62,15.54 7.62,16.61 R5.1 7.47,16.76 6.86,17.37 | 6.86,20.12 6.71,20.27 D1.C 6.86,20.12 | 6.86,20.12 7.47,19.51 7.47,19.05 C16.1 7.47,18.9 6.86,18.29 6.86,17.37 | 6.86,20.12 7.01,20.12 8.69,21.79 C15.1 | C22.2 9.14,9.91 v10.21,9.91 13.56,9.91 15.7,12.04 16.31,12.04 U$3.P$17 | v6.71,17.37 6.86,17.37
  Bottom 0.152: v6.71,17.37 6.71,13.41 v10.21,9.91
WR  (via drill 0.3)
  Top 0.152: v43.74,8.99 43.43,8.69 43.43,7.92 IC1.10 | v26.98,17.37 v33.38,17.37 | v13.11,11.89 13.72,11.89 15.7,13.87 16.31,13.87 U$3.P$14
  Bottom 0.152: v43.74,8.99 44.04,8.99 45.57,10.52 45.57,11.12 39.32,17.37 v33.38,17.37 | v26.98,17.37 25.15,17.37 19.05,11.28 13.72,11.28 v13.11,11.89